# Altium project FEV-60_IO_Board.PrjPcb
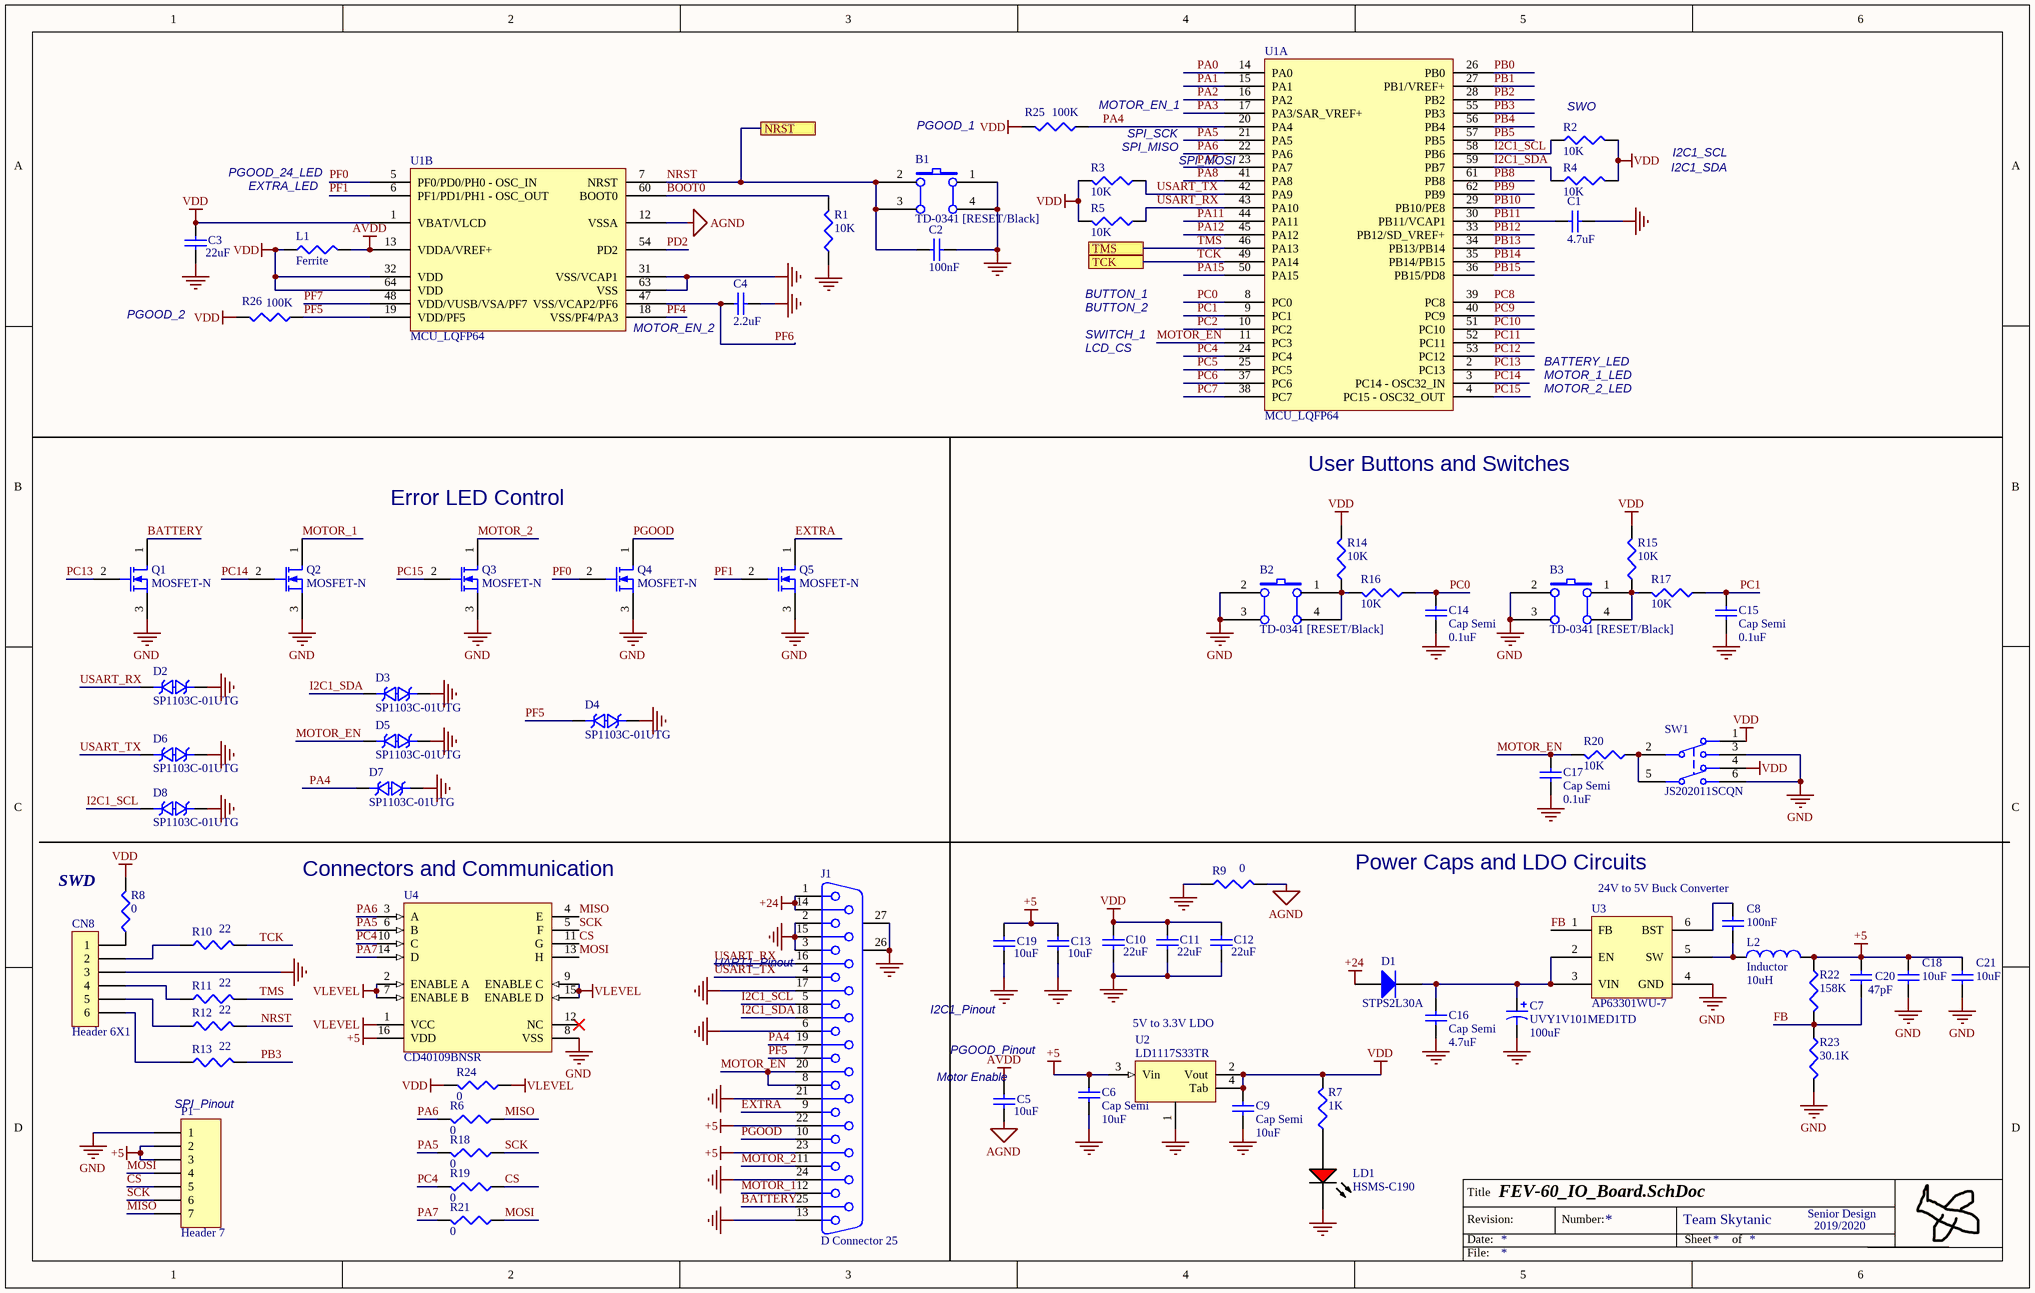
[diagram p0: FEV-60_IO_Board.SchDoc]
1 sheet, 74 parts. Net scope: flat (ports and power ports of the same name join across sheets).
Board file: FEV-60_IO_Board.PcbDoc

## Sheet FEV-60_IO_Board.SchDoc
size B

### Parts
B1  TD-0341 [RESET/Black]  [Button]
B2  TD-0341 [RESET/Black]  [Button]
B3  TD-0341 [RESET/Black]  [Button]
C1  value 4.7uF  [1608[0603]]  (hidden comment: Cap Semi)
C2  value 100nF  [1608[0603]]  (hidden comment: Cap Semi)
C3  value 22uF  [1608[0603]]  (hidden comment: Cap Semi)
C4  value 2.2uF  [1608[0603]]  (hidden comment: Cap Semi)
C5  value 10uF  [1608[0603]]  (hidden comment: Cap Semi)
C6  Cap Semi  value 10uF  [1608[0603]]
C7  UVY1V101MED1TD  value 100uF  [UVY1V101MED1TD]
C8  value 100nF  [1608[0603]]  (hidden comment: Cap Semi)
C9  Cap Semi  value 10uF  [1608[0603]]
C10  value 22uF  [1608[0603]]  (hidden comment: Cap Semi)
C11  value 22uF  [1608[0603]]  (hidden comment: Cap Semi)
C12  value 22uF  [1608[0603]]  (hidden comment: Cap Semi)
C13  value 10uF  [1608[0603]]  (hidden comment: Cap Semi)
C14  Cap Semi  value 0.1uF  [1608[0603]]
C15  Cap Semi  value 0.1uF  [1608[0603]]
C16  Cap Semi  value 4.7uF  [1608[0603]]
C17  Cap Semi  value 0.1uF  [1608[0603]]
C18  value 10uF  [1608[0603]]  (hidden comment: Cap Semi)
C19  value 10uF  [1608[0603]]  (hidden comment: Cap Semi)
C20  value 47pF  [1608[0603]]  (hidden comment: Cap Semi)
C21  value 10uF  [1608[0603]]  (hidden comment: Cap Semi)
CN8  Header 6X1  [HDR1X6]
D1  STPS2L30A  [STPS2L30A]
D2  SP1103C-01UTG  [SP1103C-01UTG]
D3  SP1103C-01UTG  [SP1103C-01UTG]
D4  SP1103C-01UTG  [SP1103C-01UTG]
D5  SP1103C-01UTG  [SP1103C-01UTG]
D6  SP1103C-01UTG  [SP1103C-01UTG]
D7  SP1103C-01UTG  [SP1103C-01UTG]
D8  SP1103C-01UTG  [SP1103C-01UTG]
J1  D Connector 25  [DSUB1.385-2H25A]
L1  Ferrite  [J1-0603]
L2  Inductor  value 10uH  [74404084100]
LD1  HSMS-C190  [AVAG-HSMX-C190_V]
P1  Header 7  [HDR1X7]
Q1  MOSFET-N  [RK7002BMT116]
Q2  MOSFET-N  [RK7002BMT116]
Q3  MOSFET-N  [RK7002BMT116]
Q4  MOSFET-N  [RK7002BMT116]
Q5  MOSFET-N  [RK7002BMT116]
R1  value 10K  [J1-0603]  (hidden comment: Res3)
R2  value 10K  [J1-0603]  (hidden comment: Res3)
R3  value 10K  [J1-0603]  (hidden comment: Res3)
R4  value 10K  [J1-0603]  (hidden comment: Res3)
R5  value 10K  [J1-0603]  (hidden comment: Res3)
R6  value 0  [J1-0603]  (hidden comment: Res3)
R7  value 1K  [J1-0603]  (hidden comment: Res3)
R8  value 0  [J1-0603]  (hidden comment: Res3)
R9  value 0  [J1-0603]  (hidden comment: Res3)
R10  value 22  [J1-0603]  (hidden comment: Res3)
R11  value 22  [J1-0603]  (hidden comment: Res3)
R12  value 22  [J1-0603]  (hidden comment: Res3)
R13  value 22  [J1-0603]  (hidden comment: Res3)
R14  value 10K  [J1-0603]  (hidden comment: Res3)
R15  value 10K  [J1-0603]  (hidden comment: Res3)
R16  value 10K  [J1-0603]  (hidden comment: Res3)
R17  value 10K  [J1-0603]  (hidden comment: Res3)
R18  value 0  [J1-0603]  (hidden comment: Res3)
R19  value 0  [J1-0603]  (hidden comment: Res3)
R20  value 10K  [J1-0603]  (hidden comment: Res3)
R21  value 0  [J1-0603]  (hidden comment: Res3)
R22  value 158K  [J1-0603]  (hidden comment: Res3)
R23  value 30.1K  [J1-0603]  (hidden comment: Res3)
R24  value 0  [J1-0603]  (hidden comment: Res3)
R25  value 100K  [J1-0603]  (hidden comment: Res3)
R26  value 100K  [J1-0603]  (hidden comment: Res3)
SW1  JS202011SCQN  [CKCP-JS202011SCQN-6_V]
U1  MCU_LQFP64  [STM32F030R8]  (parts A,B of 2)
U2  LD1117S33TR  [LD1117S33TR]
U3  AP63301WU-7  [AP63301WU-7]
U4  CD40109BNSR  [NS0016A_N]

### Ports
NRST, TCK, TMS

### Nets
+5: C6.2 C13.2 C18.2 C19.2 C20.2 C21.2 J1.22 J1.23 L2.2 P1.2 P1.3 R22.1 U2.3(Vin) U4.16(VDD)
+24: D1.1(A) J1.1 J1.14
AGND: C5.1 R9.2 U1.12(VSSA)
AVDD: C5.2 L1.2 U1.13(VDDA/VREF+)
GND: B1.1(A0) B1.4(A1) B2.2(B0) B2.3(B1) B3.2(B0) B3.3(B1) C1.1 C2.1 C3.1 C4.1 C6.1 C7.2 C9.1 C10.1 C11.1 C12.1 C13.1 C14.1 C15.1 C16.1 C17.1 C18.1 C19.1 C21.1 CN8.3 D2.1(A) D3.1(A) D4.1(A) D5.1(A) D6.1(A) D7.1(A) D8.1(A) J1.2 J1.3 J1.6 J1.13 J1.15 J1.17 J1.21 J1.24 J1.26(MH1) J1.27(MH2) LD1.2(K) P1.1 Q1.3(S) Q2.3(S) Q3.3(S) Q4.3(S) Q5.3(S) R1.1 R9.1 R23.2 SW1.3 SW1.6 U1.31(VSS/VCAP1) U1.63(VSS) U2.1 U3.4(GND) U4.8(VSS)
VDD: C3.2 C9.2 C10.2 C11.2 C12.2 L1.1 R2.2 R3.2 R4.2 R5.2 R7.2 R8.2 R14.2 R15.2 R24.2 R25.2 R26.2 SW1.1 SW1.4 U1.1(VBAT/VLCD) U1.32(VDD) U1.64(VDD) U2.2(Vout) U2.4(Tab)
VLEVEL: R24.1 U4.1(VCC) U4.2(ENABLE_A) U4.7(ENABLE_B) U4.9(ENABLE_C) U4.15(ENABLE_D)
BATTERY: J1.25 Q1.1(D)
BOOT0: R1.2 U1.60(BOOT0)
CS: P1.5 R19.1 U4.11(G)
EXTRA: J1.9 Q5.1(D)
FB: C20.1 R22.2 R23.1 U3.1(FB)
I2C1_SCL: D8.2(K) J1.5 R2.1 U1.58(PB6)
I2C1_SDA: D3.2(K) J1.18 R4.1 U1.59(PB7)
MISO: P1.7 R6.1 U4.4(E)
MOSI: P1.4 R21.1 U4.13(H)
MOTOR_1: J1.12 Q2.1(D)
MOTOR_2: J1.11 Q3.1(D)
MOTOR_EN: C17.2 D5.2(K) J1.8 J1.20 R20.2 U1.11(PC3)
NRST: B1.2(B0) B1.3(B1) C2.2 R12.2 U1.7(NRST) ; port NRST
PA0: U1.14(PA0)
PA1: U1.15(PA1)
PA2: U1.16(PA2)
PA3: U1.17(PA3/SAR_VREF+)
PA4: D7.2(K) J1.19 R25.1 U1.20(PA4)
PA5: R18.2 U1.21(PA5) U4.6(B)
PA6: R6.2 U1.22(PA6) U4.3(A)
PA7: R21.2 U1.23(PA7) U4.14(D)
PA8: U1.41(PA8)
PA11: U1.44(PA11)
PA12: U1.45(PA12)
PA15: U1.50(PA15)
PB0: U1.26(PB0)
PB1: U1.27(PB1/VREF+)
PB2: U1.28(PB2)
PB3: R13.2 U1.55(PB3)
PB4: U1.56(PB4)
PB5: U1.57(PB5)
PB8: U1.61(PB8)
PB9: U1.62(PB9)
PB10: U1.29(PB10/PE8)
PB11: C1.2 U1.30(PB11/VCAP1)
PB12: U1.33(PB12/SD_VREF+)
PB13: U1.34(PB13/PB14)
PB14: U1.35(PB14/PB15)
PB15: U1.36(PB15/PD8)
PC0: C14.2 R16.1 U1.8(PC0)
PC1: C15.2 R17.1 U1.9(PC1)
PC2: U1.10(PC2)
PC4: R19.2 U1.24(PC4) U4.10(C)
PC5: U1.25(PC5)
PC6: U1.37(PC6)
PC7: U1.38(PC7)
PC8: U1.39(PC8)
PC9: U1.40(PC9)
PC10: U1.51(PC10)
PC11: U1.52(PC11)
PC12: U1.53(PC12)
PC13: Q1.2(G) U1.2(PC13)
PC14: Q2.2(G) U1.3(PC14_-_OSC32_IN)
PC15: Q3.2(G) U1.4(PC15_-_OSC32_OUT)
PD2: U1.54(PD2)
PF0: Q4.2(G) U1.5(PF0/PD0/PH0_-_OSC_IN)
PF1: Q5.2(G) U1.6(PF1/PD1/PH1_-_OSC_OUT)
PF4: U1.18(VSS/PF4/PA3)
PF5: D4.2(K) J1.7 R26.1 U1.19(VDD/PF5)
PF6: C4.2 U1.47(VSS/VCAP2/PF6)
PF7: U1.48(VDD/VUSB/VSA/PF7)
PGOOD: J1.10 Q4.1(D)
SCK: P1.6 R18.1 U4.5(F)
TCK: R10.2 U1.49(PA14) ; port TCK
TMS: R11.2 U1.46(PA13) ; port TMS
USART_RX: D2.2(K) J1.16 R5.1 U1.43(PA10)
USART_TX: D6.2(K) J1.4 R3.1 U1.42(PA9)
NetB2_1: B2.1(A0) B2.4(A1) R14.1 R16.2
NetB3_1: B3.1(A0) B3.4(A1) R15.1 R17.2
NetC7_1: C7.1 C16.2 D1.2(K) U3.2(EN) U3.3(VIN)
NetC8_1: C8.1 L2.1 U3.5(SW)
NetC8_2: C8.2 U3.6(BST)
NetCN8_1: CN8.1 R8.1
NetCN8_2: CN8.2 R10.1
NetCN8_4: CN8.4 R11.1
NetCN8_5: CN8.5 R12.1
NetCN8_6: CN8.6 R13.1
NetLD1_1: LD1.1(A) R7.1
NetR20_1: R20.1 SW1.2(COM) SW1.5(COM)

Not connected (* = marked no-connect by the designer): U4 12(NC)*

### Notes on the sheet
- PGOOD_1
- (near R25) MOTOR_EN_1
- (near R3) SPI_MISO
- SPI_SCK
- (near R3) SPI_MOSI
- (near R2) SWO
- I2C1_SCL
- PGOOD_24_LED
- EXTRA_LED
- I2C1_SDA
- BUTTON_1
- PGOOD_2
- (near U1) MOTOR_EN_2
- BUTTON_2
- SWITCH_1
- LCD_CS
- BATTERY_LED
- MOTOR_1_LED
- MOTOR_2_LED
- Error LED Control
- User Buttons and Switches
- SWD
- (near U4) Connectors and Communication
- Power Caps and LDO Circuits
- 24V to 5V Buck Converter
- UART1_Pinout
- (near J1) I2C1_Pinout
- 5V to 3.3V LDO
- (near P1) SPI_Pinout
- (near J1) Motor Enable
- (near J1) PGOOD_Pinout
- Title
- Date:
- Revision:
- Number:
- Team Skytanic
- Sheet
- of
- Senior Design
- 2019/2020
- File:

### Library data of the parts
B1-B3 = SW PUSHBUTTON: SE PUSHBUTTON
C1-C6 C8-C21 = Cap Semi: Capacitor (Semiconductor SIM Model); Published: 8-Jun-2000; LatestRevisionDate: 29-May-2009; LatestRevisionNote: IPC-7351 Footprint Added.; PackageReference: C1206; Publisher: Altium Limited; PackageDescription: Chip Capacitor
C7 = UVY1V101MED1TD: Polarized Capacitor (Axial); Published: 8-Jun-2000; LatestRevisionDate: 17-Jul-2002; LatestRevisionNote: Re-released for DXP Platform.; PackageReference: POLAR0.8; Publisher: Altium Limited; PackageDescription: Polarized Capacitor; 2 Leads
CN8 = Header 6X1: Header, 6-Pin, Single row; LatestRevisionDate: 17-Jul-2002; LatestRevisionNote: Re-released for DXP Platform.; Publisher: Altium Limited
D1 = STPS2L30A: Manuf_1: STM; Provided: ST; Order: BAT60JFILM; ECCN_US/EU: EAR99/NEC; Revision: July-2002: Re-released for DXP Platform.; Manuf_Part_1: BAT60JFILM; Distrib: ST
D2-D8 = SP1103C-01UTG: 9V (Typ) Clamp 80A (8/20µs) Ipp Tvs Diode Surface Mount 2-DFN (1.6x1); Manuf: Littelfuse Inc.; Order: F10154CT-ND; Purchase Link: https://www.digikey.com/product-detail/en/littelfuse-inc/SP1103C-01UTG/F10154CT-ND/7402659; Manuf_Part_Num: SP1103C-01UTG; Distrib: Digi-Key; Package: 0603/2-DFN
J1 = D Connector 25: Receptacle Assembly, 25 Position, Right Angle; PackageDocument: U; Positions: 25; Published: 15-Jun-2001; LatestRevisionDate: 17-Jul-2002; LatestRevisionNote: Re-released for DXP Platform.; DatasheetDocument: 19-Mar-1999; PackageReference: 787202; Publisher: Altium Limited; Orientation: Right Angle; Gender: Receptacle
L1 R1-R26 = Res3: Resistor; Published: 8-Jun-2000; LatestRevisionDate: 29-May-2009; LatestRevisionNote: IPC-7351 Footprint Added.; PackageReference: J1-0603; Publisher: Altium Limited; PackageDescription: Chip Resistor
L2 = Inductor: Code_IEC: 1005; Published: 8-Jun-2000; LatestRevisionDate: 29-May-2009; LatestRevisionNote: IPC-7351 Footprint Added.; PackageReference: 0402-A; Publisher: Altium Limited; PackageDescription: Chip Inductor; Code_JEITA: 0402
LD1 = CMP-2000-06427-1: LED Uni-Color Red, 52 mW, 20 mA, -40 to 85 degC, 2-Pin SMD, RoHS, Tape and Reel; Manufacturer: Avago; Reverse Voltage: 5V; Viewing Angle: 170deg; High Brightness: No; Lens Type: ColorlessDiffused; DELETED: Compliant; Product Height (mm): 0.8mm; Dominant Wave Length: 626nm; Number of  Elements: 1; Chip Material: GaP; Lum Intensity: 10mcd; Product Length (mm): 1.6mm; Forward Voltage: 2.6V; Power Dissipation: 52W; Shape Type: Rectangular; Forward Current: 25mA; Peak Wavelength: 630nm; Test Current (It): 20mA; Main Category: ChipLED; Lens Dimensions: 1x0.8x0.5mm; Pin Count: 2; Package Reference: HSMX-C190; Mounting Technology: SurfaceMount; Mounting: SurfaceMount; Datasheet URL: http://docs.avagotech.com/docs/AV02-0551EN; Package Type: ChipLed; Operating Temperature Classification: Industrial; Datasheet Version: 03/2012; Operating Temp Range: -40Cto85C; Emitting Color: Red; Rad Hardened: No; Manufacturer URL: http://www.avagotech.com/; Luminous Intensity: 10mcd; Package Description: 2-Pin Surface Mount Device, Body 1.6 x 0.8 mm, Height 0.9 mm; Type: Uni-Color; Packaging: TapeandReel; Product Depth (mm): 0.8mm
P1 = Header 7: Header, 7-Pin; LatestRevisionDate: 17-Jul-2002; LatestRevisionNote: Re-released for DXP Platform.; Publisher: Altium Limited
Q1-Q5 = MOSFET-N: N-Channel MOSFET; Published: 8-Jun-2000; LatestRevisionDate: 17-Jul-2002; LatestRevisionNote: Re-released for DXP Platform.; PackageVersion: 1995/1996; PackageReference: E3; Publisher: Altium Limited; PackageDescription: TO, Flat Index; 3 In-Line, Axial Leads; Body Dia. 4.6mm; Lead Dia. 0.5 mm (max)
SW1 = CMP-2000-05087-1: Switch Slide DPDT, 0.3 A, 6 V, -40 to 85 degC, 6-Pin SMD, RoHS, Tape and Reel; Manufacturer: C&K Components; Contact Rating @ Voltage: 0.3@6VDCA; COO: US; Maximum DC Voltage Rating: 6V; Minimum Insulation Resistance: 100MOhm; Actuator Color: Black; Body Orientation: Straight; Actuator Material: Nylon4/6; Dielectric Strength: 500VAC; Maximum Contact Resistance: 70mOhm; Actuator Style: TopSlide; Electrical Life: 15000Cycles; Seal Location: N/A; Base Material: N/A; Mechanical Life: N/A; Switch Configuration: N/A; HTS: 8536509050; Contact Material: CopperAlloy; Supplier Standard Pack: 5,000; Manufacturer URL: http://www.ckswitches.com; Supplier: C&KComponents; Datasheet URL: http://datasheet.octopart.com/JS202011SCQN-C%26K-Components-datasheet-62100994.pdf; Housing Material: Nylon4/6; Product Weight: N/A; Dimension: 9x7.5x5.5mm; Maximum AC Voltage Rating: N/A; ECCN: EAR99; Contact Plating: Silver; Pole Throw Configuration: DPDT; Packaging: TapeandReel; Part No: JS202011SCQN; Datasheet Version: Sep-15; Seal Description: N/A; RoHS: Yes; Mounting: SurfaceMount,GullWing; Family: JS; Type: Sub-Miniature; Operating Temperature: -40to85C
U2 = LD1117
U3 = AP63301WU-7: Buck Switching Regulator IC Positive Adjustable 0.8V 1 Output 3A SOT-23-6 Thin, TSOT-23-6; ComponentLink1Description: Digikey; ComponentLink1URL: https://www.digikey.com/product-detail/en/diodes-incorporated/AP63301WU-7/31-AP63301WU-7CT-ND/10492238
U4 = CMP-1527-00005-2: CMOS Quad Low-to-High Voltage Level Shifter, 3 to 18 V, -55 to 125 degC, 16-Pin SO (NS16), RoHS, Tape and Reel; Manufacturer: Texas Instruments; Number of Channels: 4; VSS: 3 to 18 V; Propagation Delay: 240 ns Max.; ComponentLink2Description: Datasheet; PackageDescription: 16-Pin Plastic Small Outline Package, Body 10.2 x 5.3 mm, Pitch 1.27 mm; Mounting Technology: Surface Mount; Number of Outputs: 4; ComponentLink3URL: http://www.ti.com/lit/ml/msop002a/msop002a.pdf; Packing: Tape and Reel; RoHS: TRUE; Temperature Range: -55 to 125 degC; PartNumber: CD40109BNSR; PackageVersion: 4040062/C; ComponentLink3Description: Package Specification; DatasheetVersion: SCHS099B; ComponentLink2URL: http://www.ti.com/lit/ds/symlink/cd40109b.pdf; Package Reference: NS0016A; Number of Bits: 4; ComponentLink1Description: Manufacturer URL; ComponentLink1URL: www.ti.com